# EasyEDA Pro project bitTree-PCB_2024-10-30.epro

# Board PCB2
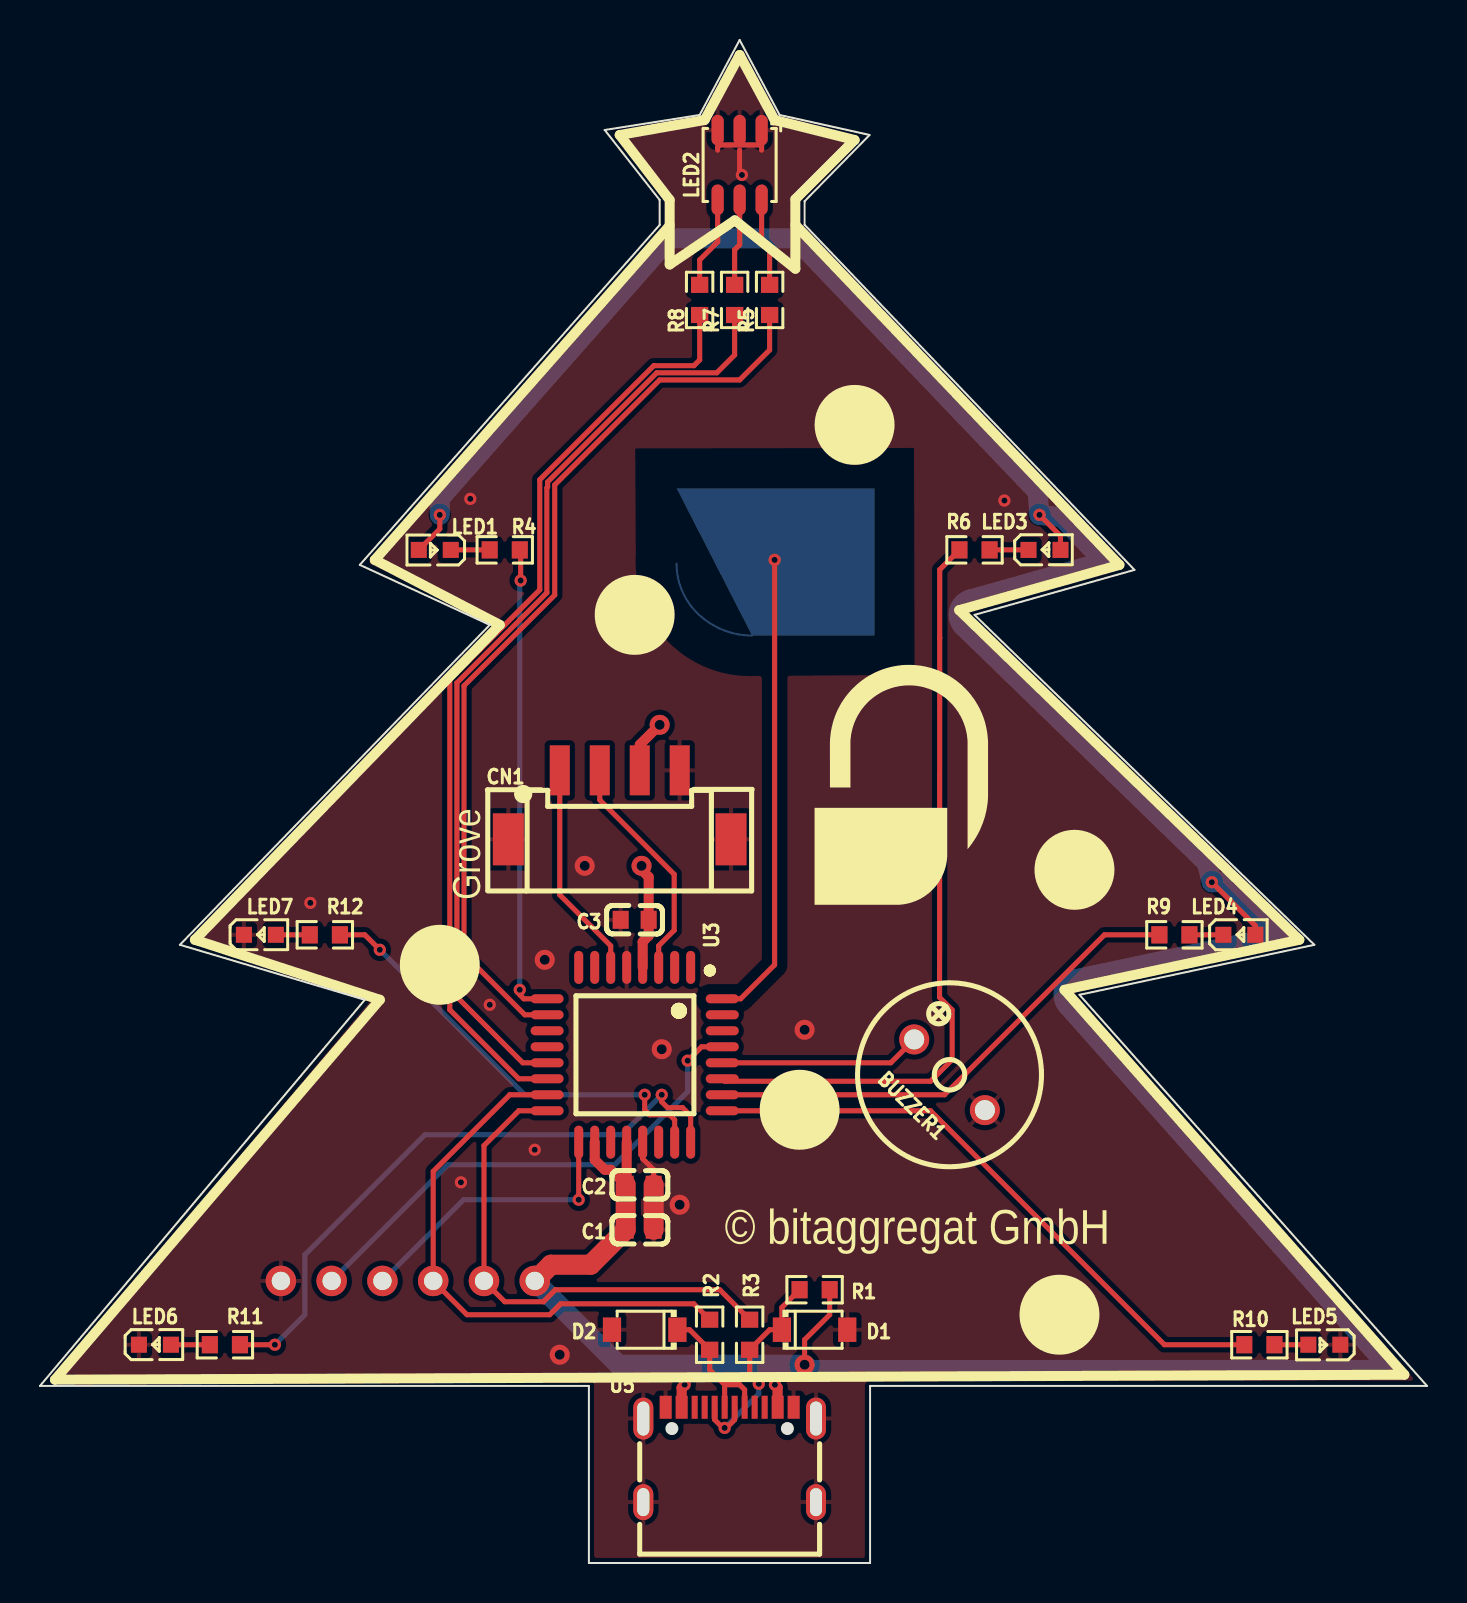
[diagram p0: board, top side]
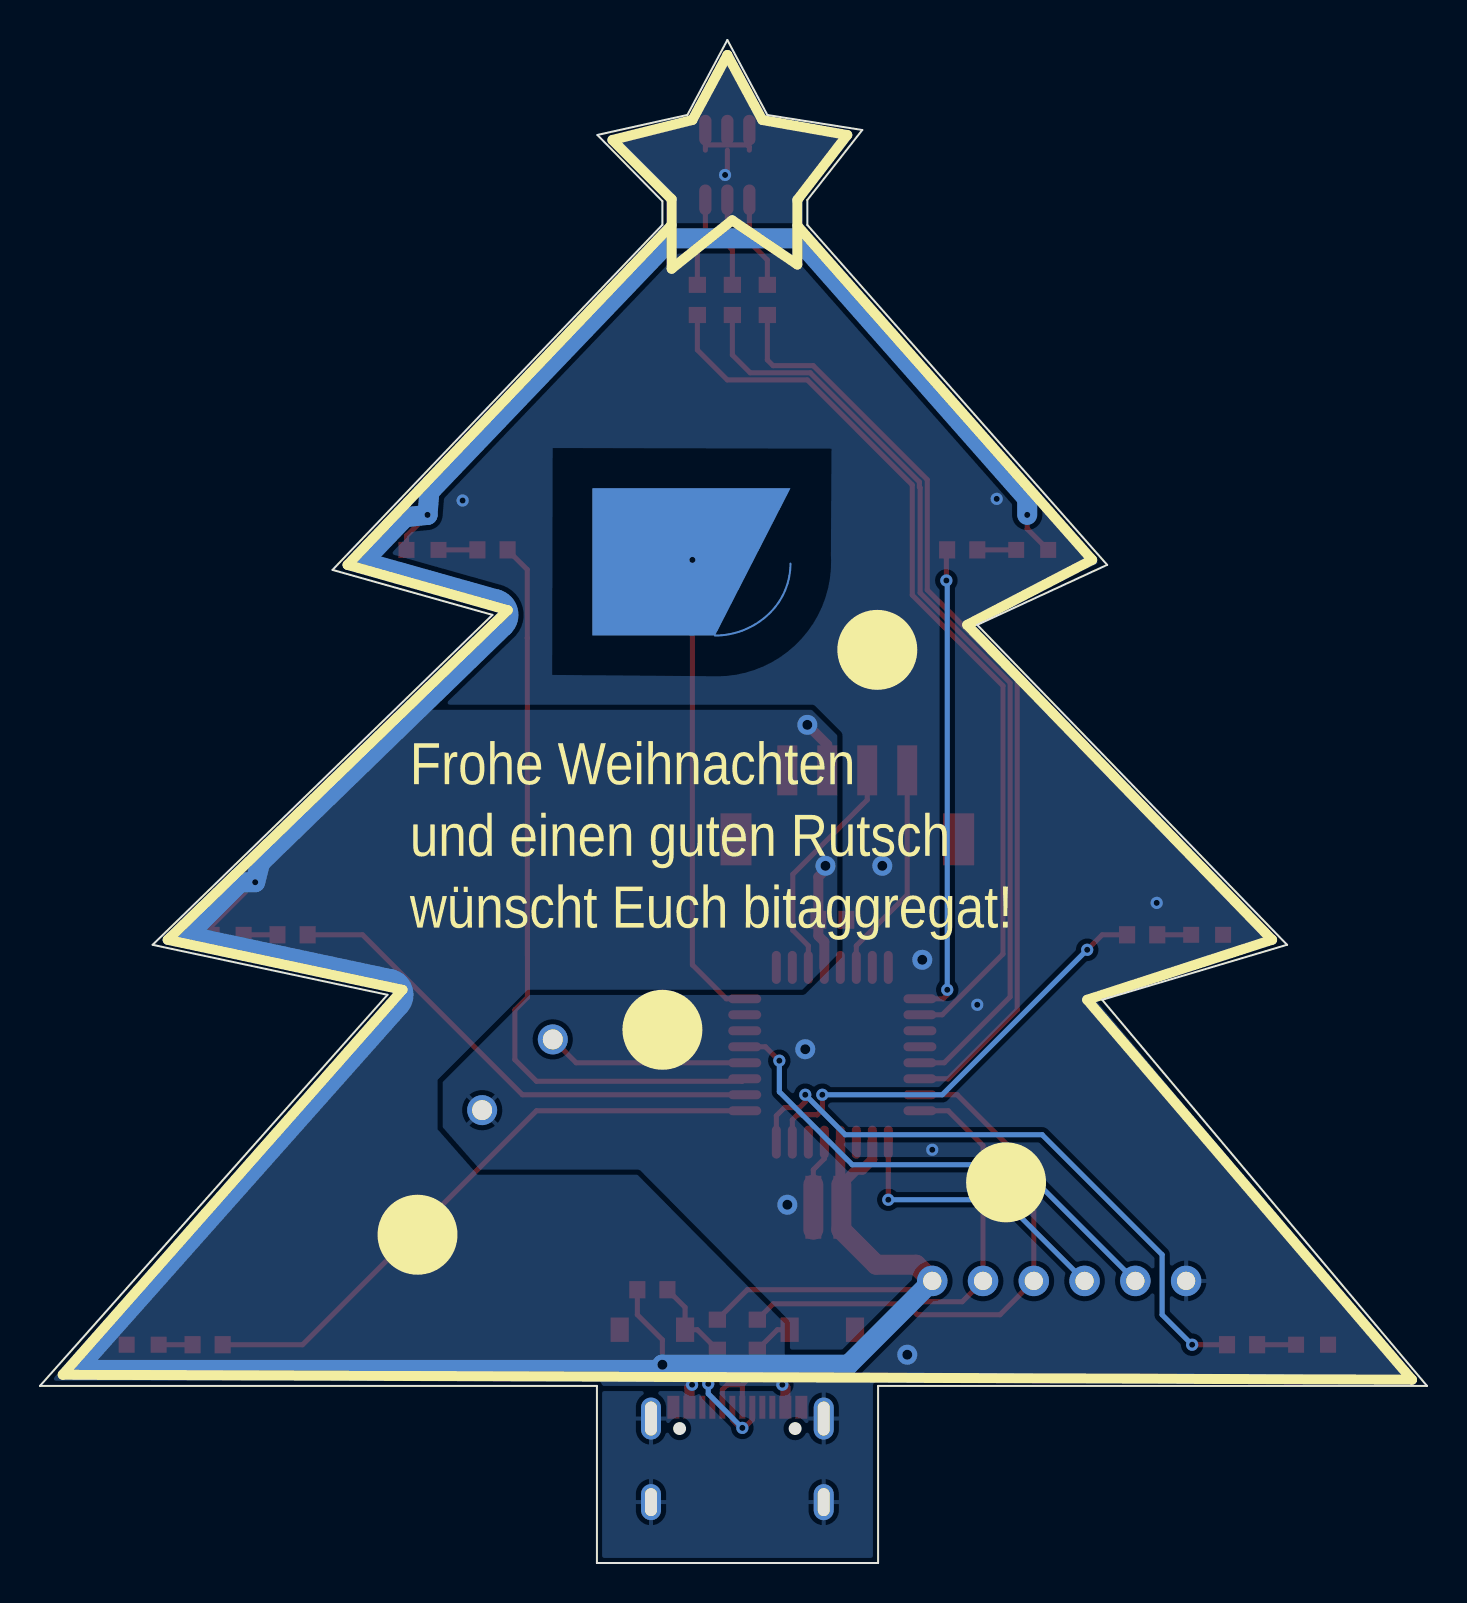
[diagram p1: board, bottom side, seen from below]

Outline 69.39 x 76.17 mm; copper layers: Top Layer, Bottom Layer. Coordinates in mm from the lower left corner of the outline.
Outline path: 0,8.86 16.25,28.17 7,30.92 22.5,46.92 16,49.92 31,66.92 31,68.17 28.25,71.67 33,72.42 35,76.17 37,72.42 41.5,71.42 38.25,68.11 38.25,66.92 54.75,49.67 46.75,47.42 63.75,30.92 52,28.42 69.39,8.86 41.53,8.86 41.53,0 27.46,0 27.46,8.86 0,8.86
Stack: Top Layer 0.035mm / Dielectric1 1.51mm FR4 er 4.5 / Bottom Layer 0.035mm

## Design rules (mm)
template: Custom Config
spacing copperThickness1oz (default): track to track 0.102, other pairs 0.152 to 0.3
spacing copperThickness2oz: track to track 0.203, other pairs 0.152 to 0.3
spacing QTouchSpaceing: track to track 0.152, other pairs 0.152 to 0.381
track width copperThickness1oz (default): min 0.127, default 0.254, max 2.54
track width copperThickness2oz: min 0.203, default 0.254, max 2.54
differential pair differentialPair (default): width min 0.127, default 0.254, max 2.54; gap min 0.152, default 0.152
via viaSize (default): diameter min 0.5, default 0.61, max 10; hole min 0.3, default 0.305, max 6.3
net QTOUCH uses QTouchRegionSpacing

## Placement (name value [footprint] x y rotation side)
BUZZER1  2.9kHz  [BUZ-TH_BD9.0-P5.00-D0.6-L-FD]  45.5 24.42 315 top
C1  4.7uF  [C0603]  30 16.67 180 top
C2  470nF  [C0603]  30 18.92 180 top
C3  470nF  [C0603]  29.75 32.17 0 top
CN1  ZX-HY2.0-4PLT  [CONN-SMD_4P-P2.00_HY2.0-4P]  29 37.92 0 top
D1  BZT52C3V6  [SOD-123_L2.7-W1.6-LS3.7-RD]  38.75 11.67 0 top
D2  BZT52C3V6  [SOD-123_L2.7-W1.6-LS3.7-RD]  30.25 11.67 180 top
LED1  KT-0603R  [LED0603-RD]  19.75 50.67 180 top
LED2  TC3838RGBE07-3CJH-E19  [LED-SMD_6P-L3.5-W3.5-BL]  35 69.92 180 top
LED3  KT-0603R  [LED0603-RD]  50.25 50.67 0 top
LED4  KT-0603R  [LED0603-RD]  60 31.42 0 top
LED5  KT-0603R  [LED0603-RD]  64.25 10.92 180 top
LED6  KT-0603R  [LED0603-RD]  5.75 10.92 0 top
LED7  KT-0603R  [LED0603-RD]  11 31.42 0 top
R1  1.5kΩ  [R0603]  38.75 13.67 0 top
R2  68Ω  [R0603]  33.5 11.42 90 top
R3  68Ω  [R0603]  35.5 11.42 90 top
R4  180Ω  [R0603]  23.25 50.67 180 top
R5  470Ω  [R0603]  36.5 63.17 270 top
R6  180Ω  [R0603]  46.75 50.67 0 top
R7  680Ω  [R0603]  34.75 63.17 270 top
R8  1kΩ  [R0603]  33 63.17 270 top
R9  180Ω  [R0603]  56.75 31.42 0 top
R10  180Ω  [R0603]  61 10.92 0 top
R11  180Ω  [R0603]  9.25 10.92 180 top
R12  180Ω  [R0603]  14.25 31.42 180 top
U2  d4d6a992c02a4993a15c56ae69694e36  [QTouch-BA]  41.75 64.42 180 bottom
U3  ATMEGA328PB-AUR  [TQFP-32_L7.0-W7.0-P0.80-LS9.0-BL]  29.75 25.42 180 top
U4  -  [ProgrammingHeader]  24.75 14.11 90 top
U5  GT-USB-7010AN  [USB-SMD_GT-USB-7010AN]  34.5 5.42 0 top

## Footprints (pads in the part's own frame, mm; a bottom-side part is the same pattern mirrored in y, then rotated)
BUZ-TH_BD9.0-P5.00-D0.6-L-FD
  round 1.5 hole 1: 1(-2.5,0) 2(2.5,0)
C0603
  rect 0.8x0.9 smd: 1(-0.7,0) 2(0.7,0)
CONN-SMD_4P-P2.00_HY2.0-4P
  rect 1x2.5 smd: 1(-2.998,1.723) 2(-0.998,1.723) 3(1.004,1.726) 4(3.002,1.723)
  rect 1.55x2.6 smd: 5(-5.57,-1.726) 6(5.57,-1.726)
LED0603-RD
  rect 0.8x0.8 smd: 1(-0.799,0) 2(0.799,0)
LED-SMD_6P-L3.5-W3.5-BL
  oval 0.616x1.533 smd: 1(1.1,1.742) 2(0,1.742) 3(-1.1,1.742) 4(-1.1,-1.742) 5(0,-1.742) 6(1.1,-1.742)
ProgrammingHeader
  round 1.524 hole 0.914: 1(0,0) 2(0,2.54) 3(0,5.08) 4(0,7.62) 5(0,10.16) 6(0,12.7)
QTouch-BA
  custom 9.906x7.366 smd: 1(4.953,-14.351)
R0603
  rect 0.806x0.864 smd: 1(-0.753,0) 2(0.753,0)
SOD-123_L2.7-W1.6-LS3.7-RD
  rect 0.91x1.22 smd: 1(-1.635,0) 2(1.635,0)
TQFP-32_L7.0-W7.0-P0.80-LS9.0-BL
  oval 0.45x1.65 smd: 1(-2.8,-4.369) 2(-2,-4.369) 3(-1.2,-4.369) 4(-0.4,-4.369) 5(0.4,-4.369) 6(1.2,-4.369) 7(2,-4.369) 8(2.8,-4.369) 17(2.8,4.369) 18(2,4.369) 19(1.2,4.369) 20(0.4,4.369) 21(-0.4,4.369) 22(-1.2,4.369) 23(-2,4.369) 24(-2.8,4.369)
  oval 1.65x0.45 smd: 9(4.381,-2.8) 10(4.381,-2) 11(4.381,-1.2) 12(4.381,-0.4) 13(4.381,0.4) 14(4.381,1.2) 15(4.381,2) 16(4.381,2.8) 25(-4.381,2.8) 26(-4.381,2) 27(-4.381,1.2) 28(-4.381,0.4) 29(-4.381,-0.4) 30(-4.381,-1.2) 31(-4.381,-2) 32(-4.381,-2.8)
USB-SMD_GT-USB-7010AN
  oval 1x2.1 hole 0.6x1.7: 13(-4.32,1.808) 14(4.32,1.808)
  oval 1x1.8 hole 0.6x1.4: 15(-4.32,-2.373) 16(4.32,-2.373)
  rect 0.6x1.15 smd: A1B12(-3.2,2.373) A4B9(-2.4,2.373) B1A12(3.2,2.373) B4A9(2.4,2.373)
  rect 0.3x1.15 smd: A5(-1.25,2.373) A6(-0.25,2.373) A7(0.25,2.373) A8(1.25,2.373) B5(1.75,2.373) B6(0.75,2.373) B7(-0.75,2.373) B8(-1.75,2.373)

## Nets
GND: BUZZER1.2 C1.1 C2.1 C3.1 CN1.4 CN1.5 CN1.6 D1.2 D2.2 LED2.4 LED2.5 LED2.6 LED5.1 LED6.1 LED7.1 U3.5 U3.21 U4.6 U5.13 U5.14 U5.15 U5.16 U5.A1B12 U5.B1A12
VCC: C1.2 C2.2 C3.2 CN1.3 LED1.2 LED3.2 LED4.2 R1.2 U3.4 U3.18 U3.20 U4.1 U5.A4B9 U5.B4A9
BUZZER_NET: BUZZER1.1 U3.28
DN: D1.1 R1.1 R3.1 U5.A7 U5.B7
DP: D2.1 R2.1 U5.A6 U5.B6
LED1_NET: R4.1 U3.9
MISO: R3.2 U3.16 U4.2
MOSI: R2.2 U3.15 U4.3
QTOUCH: U2.1 U3.32
$1N1666: LED2.2 R7.1
$1N1705: LED2.3 R5.1
$1N1857: LED2.1 R8.1
$1N1908: R6.1 U3.27
$1N1914: R9.1 U3.26
$1N1921: R10.1 U3.25
$1N1928: R11.1 U3.24
$1N1935: R12.1 U3.23
$1N2040: R5.2 U3.10
$1N2044: R7.2 U3.13
$1N2051: R8.2 U3.14
$1N3584: LED1.1 R4.2
$1N3623: LED3.1 R6.2
$1N3662: LED4.1 R9.2
$1N3701: LED5.2 R10.2
$1N3740: LED6.2 R11.2
$1N3779: LED7.2 R12.2
$1N3978: U3.17 U4.4
$1N4007: U3.29 U4.5
$1N8233: CN1.2 U3.3
$1N8254: CN1.1 U3.6

Pads without a net: U3 1 2 7 8 11 12 19 22 30 31; U5 A5 A8 B5 B8

## Via types
v1: diameter 0.61, hole 0.305, Top Layer to Bottom Layer, 23 vias
v2: diameter 1, hole 0.5, Top Layer to Bottom Layer, 9 vias

## Routing (per net, layer and track width the routed paths; a pad name or vN(x,y) marks a point on that pad's centre or on a via; arc(x,y) is an arc through that point)
GND: length 8.6
  Top Layer w0.254: C2.1 30.7,19.67 30.15,20.22 U3.21 ; 33.9,70.66 33.9,70.82 34,70.92 36.1,70.92 36.1,70.66 ; v1(35.11,69.42) 35,69.53 35,70.66
  Top Layer w1: C2.1 C1.1
  vias: v1(13.52,33.01) v1(21.06,19.04) v1(21.53,53.22) v1(22.5,27.92) v1(24.75,20.67) v1(48.24,53.14) v2(25.25,30.17) v2(26,10.42) v2(27.25,34.87) v2(31.1,25.69) v2(32,17.92) v2(38.25,26.67)
VCC: length 195
  Top Layer w0.254: R1.2 39.5,12.42 38.25,11.16 v2(38.25,9.92) ; v1(20,52.42) 20,51.72 LED1.2 ; v1(58.62,34.05) 60.8,31.87 LED4.2 ; LED3.2 51.05,51.37 v1(50,52.42)
  Top Layer w0.5: U3.4 30.15,31.07 30.45,31.37 C3.2 30.45,34.31 30.09,34.67 ; v2(31,41.92) 30,40.92 CN1.3 ; U3.18 27.75,20.17 28.25,19.67 28.55,19.67 C2.2 29.35,18.97 U3.20
  Top Layer w0.508: v1(32.25,8.92) 32.1,8.77 U5.A4B9 ; v1(36.76,8.92) 36.9,8.78 U5.B4A9
  Top Layer w1: U4.1 25.56,14.92 27.55,14.92 C1.2 C2.2
  Bottom Layer w1: U4.1 28.94,9.92 v2(38.25,9.92) 38.51,9.66 67.6,9.66 51.4,27.89 arc(51.2,28.49) 51.51,29.05 arc(51.66,29.14) 51.83,29.2 62.04,31.37 59.37,34.05 v1(58.62,34.05) 58.37,35.02 46.19,46.84 arc(45.97,47.61) 46.53,48.19 53.14,50.05 53.14,50.19 51.13,52.3 v1(50,52.42) 49.91,53.58 37.79,66.25 31.48,66.25 20,53.24 v1(20,52.42)
  vias: v2(30.09,34.87)
BUZZER_NET: length 10.1
  Top Layer w0.254: U3.28 42.56,25.02 BUZZER1.1
DN: length 11.8
  Top Layer w0.254: U5.B7 33.75,7.17 34.16,6.76 v1(34.25,6.76) 34.34,6.76 34.75,7.17 U5.A7 ; v1(35.96,8.96) 35.5,9.42 R3.1 36.5,11.67 D1.1 37.12,12.79 R1.1
  Bottom Layer w0.254: v1(34.25,6.76) 35.96,8.46 v1(35.96,8.96)
DP: length 7.2
  Top Layer w0.254: 34.25,8.92 33.5,9.67 R2.1 32.5,11.67 D2.1 ; 34.25,8.92 U5.A6 ; 34.25,8.92 35,8.92 35.25,8.67 U5.B6
LED1_NET: length 23.7
  Top Layer w0.254: U3.9 24.2,28.22 24,28.42 v1(24,28.67) ; R4.1 24.04,50.63 v1(24.04,49.14)
  Bottom Layer w0.254: v1(24.04,49.14) 24,49.09 v1(24,28.67)
MISO: length 25.2
  Top Layer w0.254: U3.16 23.95,22.62 22.21,20.88 U4.2 23.25,13.07 25.18,13.07 25.78,13.67 34,13.67 R3.2
MOSI: length 27.8
  Top Layer w0.254: R2.2 32.71,12.96 26.05,12.96 25.5,12.42 21.36,12.42 U4.3 19.67,19.59 23.5,23.42 U3.15
QTOUCH: length 23.6
  Top Layer w0.254: v1(36.75,50.17) 36.75,29.92 35.05,28.22 U3.32
$1N1666: length 3.6
  Top Layer w0.254: 35,67.43 35,65.93 34.75,65.68 R7.1
$1N1705: length 3.7
  Top Layer w0.254: R5.1 36.5,65.67 36.1,66.07 36.1,67.43
$1N1857: length 3.9
  Top Layer w0.254: R8.1 33,65.17 33.9,66.07 33.9,67.43
$1N1908: length 38.2
  Top Layer w0.254: 45.01,46.26 45,28.29 45.63,27.66 45.63,25.17 44.55,24.09 34.25,24.09 U3.27 ; 45.01,46.26 45.01,49.68 R6.1 ; 45.01,46.26 45,46.26
$1N1914: length 25.2
  Top Layer w0.254: R9.1 53.25,31.42 45.25,23.42 U3.26
$1N1921: length 31
  Top Layer w0.254: R10.1 56.25,10.92 44.55,22.62 U3.25
$1N1928: length 31.4
  Top Layer w0.254: v1(31.1,23.42) 31.1,23.06 31.39,22.77 32.14,22.77 32.55,22.37 U3.24 ; v1(11.75,10.92) R11.1
  Bottom Layer w0.254: v1(31.1,23.42) 29.1,21.42 19.25,21.42 13.25,15.42 13.25,12.42 v1(11.75,10.92)
$1N1935: length 22.1
  Top Layer w0.254: v1(17,30.67) 16.25,31.42 R12.1 ; U3.23 31.75,22.16 31.5,22.42 30.5,22.42 30.25,22.67 v1(30.25,23.42)
  Bottom Layer w0.254: v1(17,30.67) 24.25,23.42 v1(30.25,23.42)
$1N2040: length 46
  Top Layer w0.254: U3.10 24.25,27.42 21.21,30.45 21.21,43.87 25.75,48.41 25.75,53.92 31,59.17 35,59.17 36.5,60.67 R5.2
$1N2044: length 47.5
  Top Layer w0.254: U3.13 24.15,25.02 20.86,28.31 20.86,44.02 25.36,48.52 25.36,53.78 25.39,53.81 25.39,54.06 30.85,59.52 33.86,59.52 34.75,60.42 R7.2
$1N2051: length 47.4
  Top Layer w0.254: R8.2 33,60.17 32.71,59.88 30.71,59.88 25,54.17 25,48.67 20.5,44.17 20.5,27.67 23.95,24.22 U3.14
$1N3584: length 1.9
  Top Layer w0.254: LED1.1 R4.2
$1N3623: length 1.9
  Top Layer w0.254: LED3.1 R6.2
$1N3662: length 1.7
  Top Layer w0.254: LED4.1 R9.2
$1N3701: length 1.7
  Top Layer w0.254: R10.2 LED5.2
$1N3740: length 1.9
  Top Layer w0.254: LED6.2 R11.2
$1N3779: length 1.7
  Top Layer w0.254: R12.2 LED7.2
$1N3978: length 14.4
  Top Layer w0.254: U3.17 v1(26.95,18.17)
  Bottom Layer w0.254: v1(26.95,18.17) 21.19,18.17 U4.4
$1N4007: length 25.3
  Top Layer w0.254: v1(32.4,25.12) 33.1,25.82 U3.29
  Bottom Layer w0.254: v1(32.4,25.12) 32.4,23.57 28.75,19.92 20.4,19.92 14.59,14.11
$1N8233: length 11.7
  Top Layer w0.254: CN1.2 28,38.17 31.72,34.44 31.72,31.64 30.95,30.87 U3.3
$1N8254: length 10.9
  Top Layer w0.254: CN1.1 26,33.42 28.55,30.87 U3.6

## Copper pours and planes (outline as drawn; the poured copper is in the pictures)
GND on Top Layer: 27.46,0 27.46,8.86 0,8.86 16.25,28.17 7,30.92 22.5,46.92 16,49.92 31,66.92 31,68.17 28.25,71.67 33,72.42 35,76.17 37,72.42 41.5,71.42 38.25,68.11 38.25,66.92 54.75,49.67 46.75,47.42 63.75,30.92 52,28.42 69.39,8.86 41.53,8.86 41.53,0
GND on Bottom Layer: 27.46,0 27.46,8.86 0,8.86 16.25,28.17 7,30.92 22.5,46.92 16,49.92 31,66.92 31,68.17 28.25,71.67 33,72.42 35,76.17 37,72.42 41.5,71.42 38.25,68.11 38.25,66.92 54.75,49.67 46.75,47.42 63.75,30.92 52,28.42 69.39,8.86 41.53,8.86 41.53,0
VCC on Bottom Layer: 69.39,8.86 32.13,8.86 32.13,11.98 39.5,19.42 47.5,19.42 49.5,21.7 49.5,24.16 44.99,28.67 31.25,28.67 29.5,30.42 29.5,41.39 30.78,42.67 51.75,42.67 63.75,30.92 52,28.42

## Text on the board
Bottom Silkscreen Layer: Frohe Weihnachten / und einen guten Rutsch / wünscht Euch bitaggregat!
Top Silkscreen Layer: Grove | © bitaggregat GmbH
